# EAGLE schematic Arduino-Mega-2560-Adapter_2 (EAGLE 6.6.0)
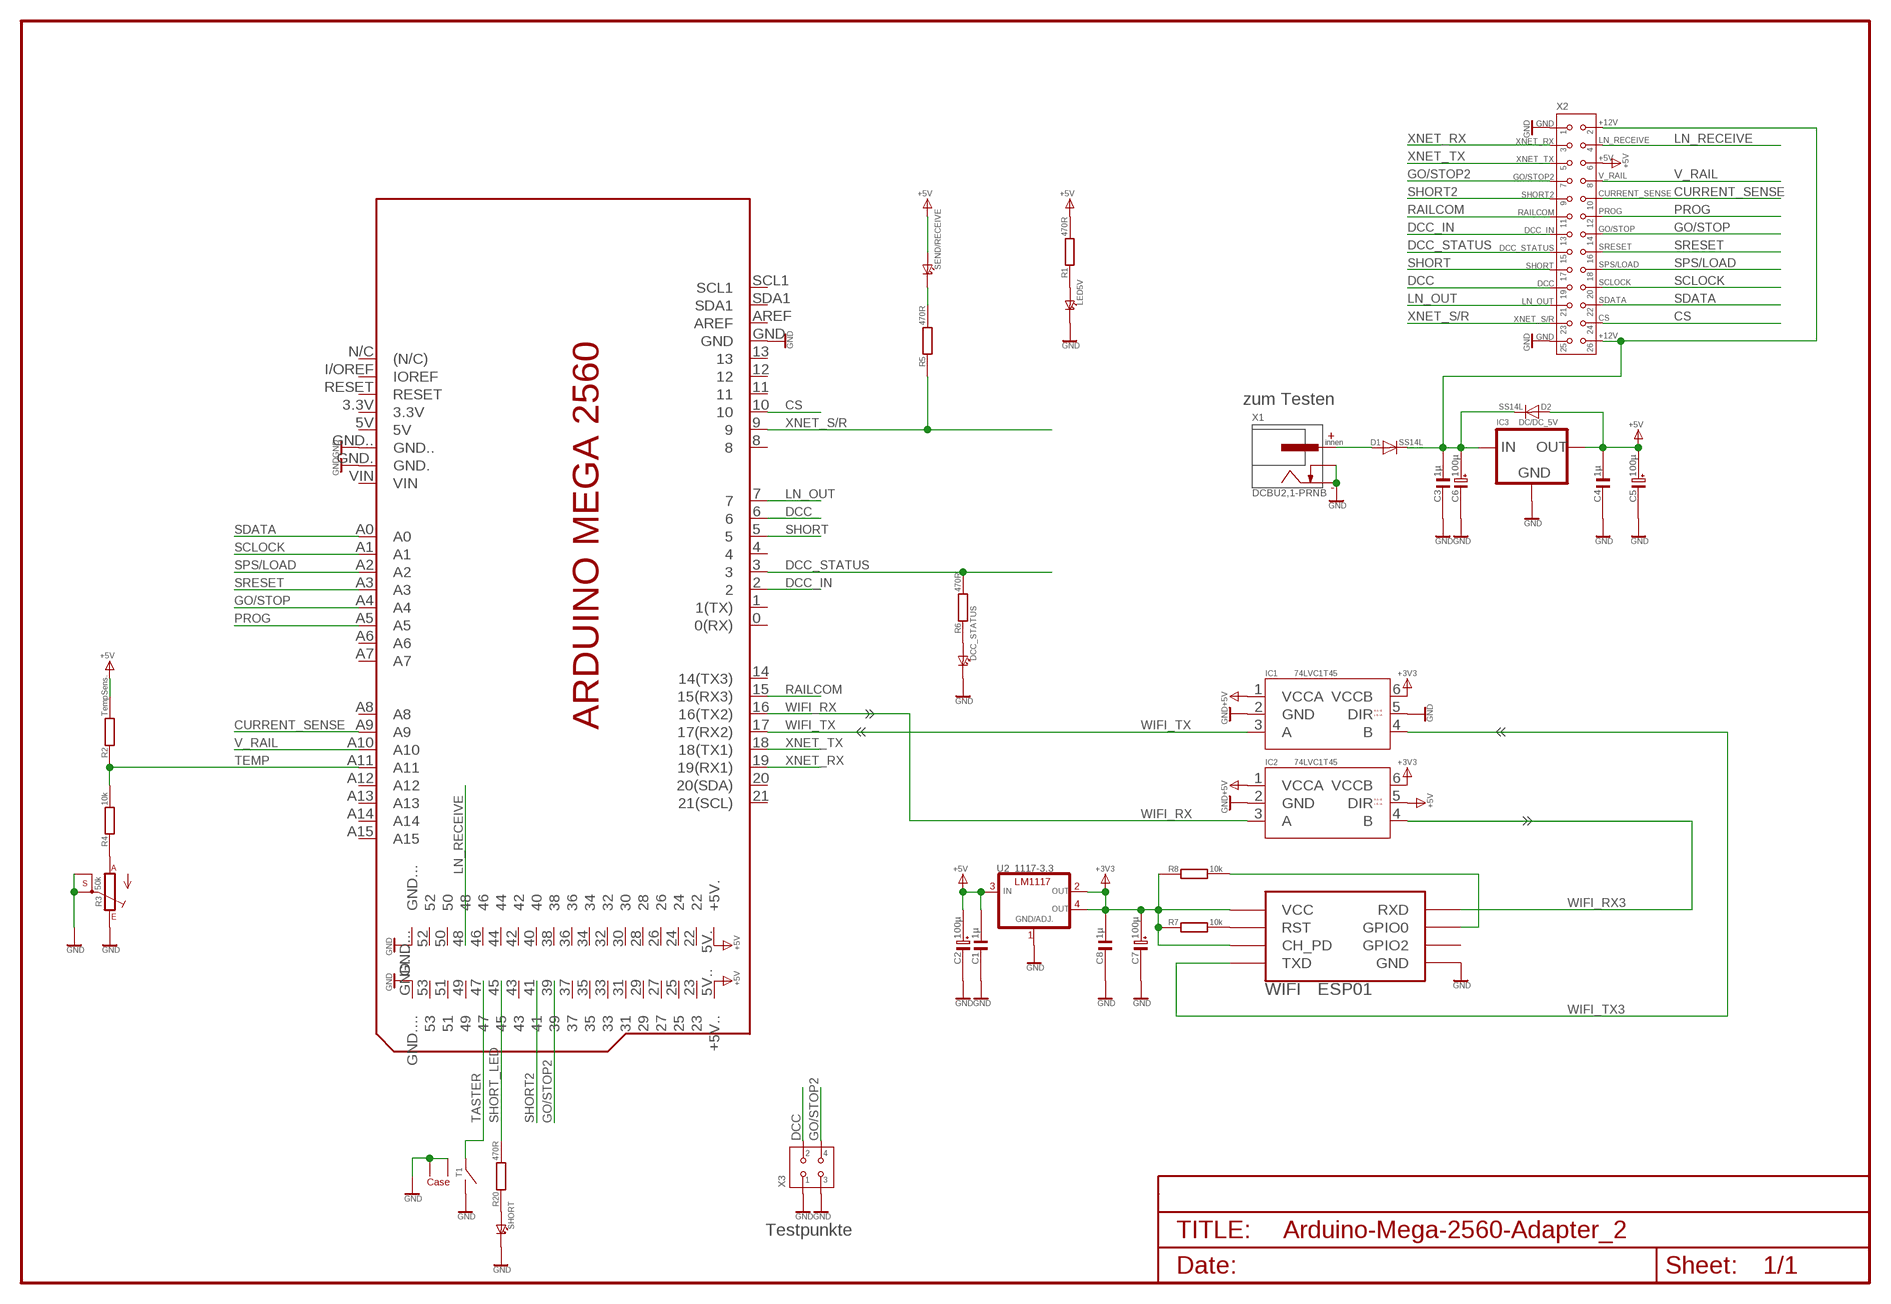
[diagram p0: schematic, sheet 1]

## Parts
C1  1µ  C0805  [C0805]
C2  100µ  ELKORM2.5_DIA6  [RM2.5_DIA6]
C3  1µ  C0805  [C0805]
C4  1µ  C0805  [C0805]
C5  100µ  ELKORM2.5_DIA6  [RM2.5_DIA6]
C6  100µ  ELKORM2.5_DIA6  [RM2.5_DIA6]
C7  100µ  ELKORM2.5_DIA6  [RM2.5_DIA6]
C8  1µ  C0805  [C0805]
D1  SS14L  DIODESUB-SMA_  [SUB-SMA_]
D2  SS14L  DIODESUB-SMA_  [SUB-SMA_]
DCC_STATUS  LED3MM_  [LED3MM_]
IC1  74LVC1T45  74LVC1T45SOT23-6  [SOT23-6_]
IC2  74LVC1T45  74LVC1T45SOT23-6  [SOT23-6_]
IC3  DC/DC_5V  78XXLSTEHEND  [78XXS]
LED5V  LED3MM_  [LED3MM_]
PCB1  ARDUINO_MEGA2560  [ARDUINO_MEGA2560]
R1  470R  R0805  [R0805]
R2  TempSens.  RRM2,5  [RM02,5]
R3  50k  TRIM_1234-S64YW  [S64YW]
R4  10k  R0603  [R0603]
R5  470R  R0805  [R0805]
R6  470R  R0805  [R0805]
R7  10k  R0603  [R0603]
R8  10k  R0603  [R0603]
R20  470R  R0805  [R0805]
SEND/RECEIVE  LED3MM_  [LED3MM_]
SHORT  LED3MM_  [LED3MM_]
T1  TACT6060-90°  TACT6060-90°_  [TACT6060-90°_]
U2  1117-3,3  LM1117_  [SOT223__]
WIFI  ESP01  [ESP01]
X1  DCBU2,1-PRNB  DC-BUCHSE2DCBU2,1-PRNB  [DCBU2,1-PRNB]
X2  2X13_WANNE_180°  [2X13_WANNE_180°]
X3  2X02_2.54MM  [2X02_2.54MM]

## Nets
+3V3: C7.PLUS C8.2 IC1.6(VCCB) IC2.6(VCCB) R7.P$1 R8.P$1 U2.2(OUT) U2.4(OUT1) WIFI.CH_PD WIFI.VCC
+5V: C1.2 C2.PLUS C4.2 C5.PLUS D2.A(ANODE) IC1.1(VCCA) IC2.1(VCCA) IC2.5(DIR) IC3.OUT PCB1.5V.(+5V.) PCB1.5V..(+5V..) R1.P$2 R2.P$2 SEND/RECEIVE.A(ANODE) U2.3(IN) X2.P$6
CS: PCB1.10 X2.P$24
CURRENT_SENSE: PCB1.A9 X2.P$10
DCC: PCB1.6 X2.P$19 X3.P$2
DCC_IN: PCB1.2 X2.P$13
DCC_STATUS: PCB1.3 R6.P$2 X2.P$15
GND: C1.1 C2.MINUS C3.1 C4.1 C5.MINUS C6.MINUS C7.MINUS C8.1 DCC_STATUS.K(KATHODE) IC1.2(GND) IC1.5(DIR) IC2.2(GND) IC3.GND LED5V.K(KATHODE) PCB1.GND PCB1.GND. PCB1.GND.. PCB1.GND... PCB1.GND.... R3.E R3.S R3.S@1(S) SHORT.K(KATHODE) T1.1 T1.3(CASE) T1.4(CASE) U2.1(GND) WIFI.GND X1.AUßEN X1.ÖFFNER X2.P$1 X2.P$25 X3.P$1 X3.P$3
GO/STOP: PCB1.A4 X2.P$14
GO/STOP2: PCB1.39 X2.P$7 X3.P$4
LN_OUT: PCB1.7 X2.P$21
LN_RECEIVE: PCB1.48 X2.P$4
N$1: R7.P$2 WIFI.RST
N$2: R5.P$2 SEND/RECEIVE.K(KATHODE)
N$3: DCC_STATUS.A(ANODE) R6.P$1
N$4: R20.P$1 SHORT.A(ANODE)
N$5: LED5V.A(ANODE) R1.P$1
N$6: R8.P$2 WIFI.GPIO0
N$7: C3.2 C6.PLUS D1.K(KATHODE) D2.K(KATHODE) IC3.IN X2.P$2 X2.P$26
N$8: D1.A(ANODE) X1.INNEN
N$9: R3.A R4.P$1
PROG: PCB1.A5 X2.P$12
RAILCOM: PCB1.15(15(RX3)) X2.P$11
SCLOCK: PCB1.A1 X2.P$20
SDATA: PCB1.A0 X2.P$22
SHORT: PCB1.5 X2.P$17
SHORT2: PCB1.41 X2.P$9
SHORT_LED: PCB1.45 R20.P$2
SPS/LOAD: PCB1.A2 X2.P$18
SRESET: PCB1.A3 X2.P$16
TASTER: PCB1.47 T1.2
TEMP: PCB1.A11 R2.P$1 R4.P$2
V_RAIL: PCB1.A10 X2.P$8
WIFI_RX: IC2.3(A) PCB1.16(16(TX2))
WIFI_RX3: IC2.4(B) WIFI.RX(RXD)
WIFI_TX: IC1.3(A) PCB1.17(17(RX2))
WIFI_TX3: IC1.4(B) WIFI.TX(TXD)
XNET_RX: PCB1.19(19(RX1)) X2.P$3
XNET_S/R: PCB1.9 R5.P$1 X2.P$23
XNET_TX: PCB1.18(18(TX1)) X2.P$5
Unconnected: PCB1.0(0(RX)) PCB1.1(1(TX)) PCB1.3.3V PCB1.4 PCB1.5V PCB1.8 PCB1.11 PCB1.12 PCB1.13 PCB1.14(14(TX3)) PCB1.20(20(SDA)) PCB1.21(21(SCL)) PCB1.22 PCB1.23 PCB1.24 PCB1.25 PCB1.26 PCB1.27 PCB1.28 PCB1.29 PCB1.30 PCB1.31 PCB1.32 PCB1.33 PCB1.34 PCB1.35 PCB1.36 PCB1.37 PCB1.38 PCB1.40 PCB1.42 PCB1.43 PCB1.44 PCB1.46 PCB1.49 PCB1.50 PCB1.51 PCB1.52 PCB1.53 PCB1.A6 PCB1.A7 PCB1.A8 PCB1.A12 PCB1.A13 PCB1.A14 PCB1.A15 PCB1.AREF PCB1.I/OREF(IOREF) PCB1.N/C((N/C)) PCB1.RESET PCB1.SCL1 PCB1.SDA1 PCB1.VIN WIFI.GPIO2

## Notes on the sheet
- zum Testen
- Testpunkte

## Library data of the parts
C1 C3 C4 C8 = C:C
C2 C5-C7 = C-Elko:ELKO
D1 D2 = Dioden:DIODE
DCC_STATUS LED5V SEND/RECEIVE SHORT = LEDs:LED
IC1 IC2 = SingleGateLogic:74LVC1T45: Pegel-Wandler
IC3 = Spannungsregler:78XXL: VOLTAGE REGULATOR
PCB1 = Arduino_Eagle_lib:ARDUINO_MEGA2560: Device for representing an Arduino Mega 2560 board with a footprint in an EAGLE design. Created by Dave Young for Element14. More EAGLE documentation at: http://www.element14.com/community/community/knode/cadsoft_eagle
R1 R4-R8 R20 = R:R
R2 = R_:R
R3 = Poti:TRIM_1234-: POTENTIOMETER
T1 = Taster:TACT6060-90°: Segor: TACT6060/Hxx
U2 = Spannungsregler:LM1117
WIFI = esp8266modules:ESP01: ESP8266 Wifi module 01
X1 = DC-Buchsen:DC-BUCHSE2
X2 = Z21-Connector:2X13
X3 = Stiftleisten:2X02